# Altium project SAMPLE.PrjPcb
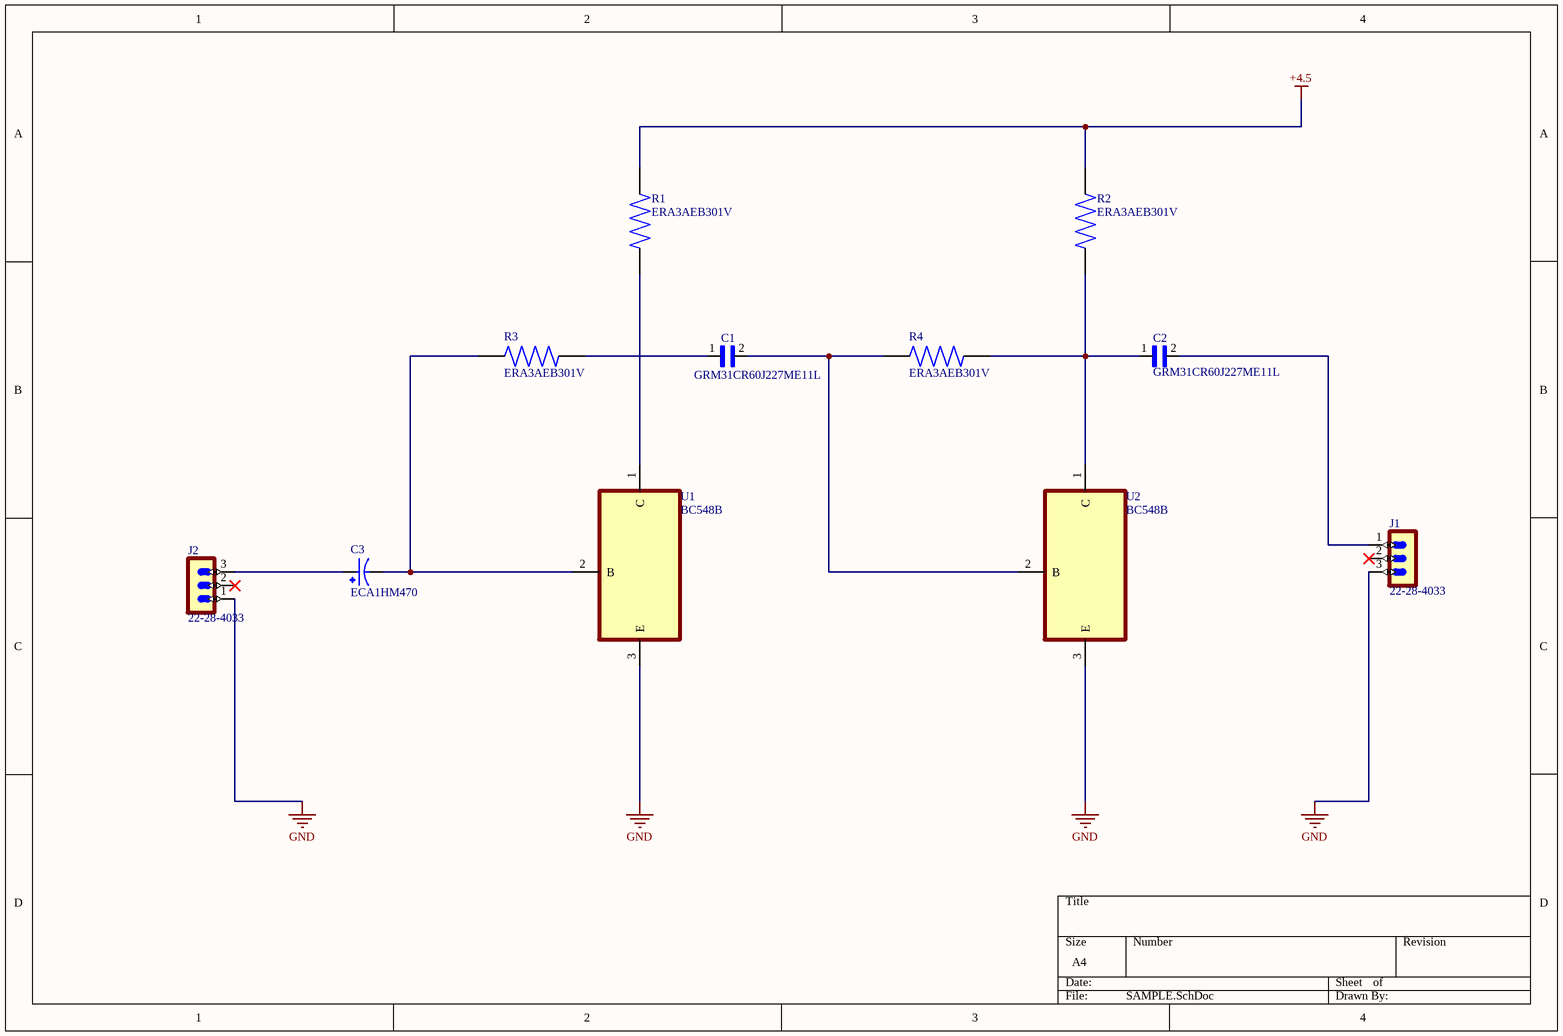
[diagram p0: SAMPLE.SchDoc]
1 sheet, 11 parts. Net scope: global (net labels, ports and power ports of the same name join across sheets).
Board file: SAMPLE.PcbDoc

## Sheet SAMPLE.SchDoc
size A4; SheetNumber: 1; SheetTotal: 1

### Parts
C1  GRM31CR60J227ME11L  [CAPC3216X190N]
C2  GRM31CR60J227ME11L  [CAPC3216X190N]
C3  ECA1HM470  [CAPPRD250W50D630H1120]
J1  22-28-4033  [1X03-PIN]
J2  22-28-4033  [1X03-PIN]
R1  ERA3AEB301V  [RES_ERA3AEB301V]
R2  ERA3AEB301V  [RES_ERA3AEB301V]
R3  ERA3AEB301V  [RES_ERA3AEB301V]
R4  ERA3AEB301V  [RES_ERA3AEB301V]
U1  BC548B  [TO127P254X732-3]
U2  BC548B  [TO127P254X732-3]

### Nets
+4.5: R1.2 R2.2
GND: J1.3 J2.1 U1.3(E) U2.3(E)
NetC1_1: C1.1 R3.2
NetC1_2: C1.2 R4.1 U2.2(B)
NetC2_1: C2.1 R2.1 R4.2 U2.1(C)
NetC2_2: C2.2 J1.1
NetC3_N: C3.N R3.1 U1.2(B)
NetC3_P: C3.P J2.3
NetR1_1: R1.1 U1.1(C)

Not connected (* = marked no-connect by the designer): J1 2*; J2 2*

### Library data of the parts
C1 C2 = GRM31CR60J227ME11L: SMD Multilayer Ceramic Capacitor, GRM Series, 220 F, 20%, X5R, 6.3 V, 1206 [3216 Metric]; MF: Murata Electronics; Digi-Key_Part_Number: 490-13970-1-ND; Package: 3216 Murata; MP: GRM31CR60J227ME11L; SnapEDA_Link: https://www.snapeda.com/parts/GRM31CR60J227ME11L/Murata%20Electronics%20North%20America/view-part/1756709/?ref=snap; Purchase-URL: https://pricing.snapeda.com/search/part/GRM31CR60J227ME11L/?ref=eda; Check_prices: https://www.snapeda.com/parts/GRM31CR60J227ME11L/Murata%20Electronics%20North%20America/view-part/1756709/?ref=eda; Value: *
C3 = ECA1HM470: 47ÂµF 50V Aluminum Electrolytic Capacitors Radial, Can 2000 Hrs @ 85Â°C; MF: Panasonic Electronic; Value: *; MP: ECA1HM470; SnapEDA_Link: https://www.snapeda.com/parts/ECA1HM470/Panasonic%20Electronic%20Components/view-part/562975/?ref=snap; Availability: In Stock; Package: RADIAL-2 Panasonic; Price: None; Check_prices: https://www.snapeda.com/parts/ECA1HM470/Panasonic%20Electronic%20Components/view-part/562975/?ref=eda; Purchase-URL: https://pricing.snapeda.com/search/part/ECA1HM470/?ref=eda
J1 J2 = 22-28-4033: Connector Header Through Hole 3 position 0.100 (2.54mm); MF: Molex; MP: 22284033; Package: None; Price: None; Value: *; SnapEDA_Link: https://www.snapeda.com/parts/22284033/Molex/view-part/?ref=snap; Availability: In Stock; Check_prices: https://www.snapeda.com/parts/22284033/Molex/view-part/?ref=eda
U1 U2 = BC548B: Transistor bipolar _BJT_ NPN 30V 100mA 300MHz 625mW Agujero pasante TO-92-3; MF: ON Semiconductor; MP: BC548B; Price: None; Availability: Unavailable; Package: TO-92 Motorola; SnapEDA_Link: https://www.snapeda.com/parts/BC548B/ON%20Semiconductor/view-part/697038/?ref=snap; Value: *
R1-R4 = ERA3AEB301V: Package: None; MP: ERA3AEB301V; Price: None; Availability: Unavailable; Value: *